# Altium schematic sheet Retroreflective Sensor.SchDoc
size A4; Organization: Altium Limited; Address1: L3, 12a Rodborough Rd; Address2: Frenchs Forest; Address3: NSW; Address4: Australia 2086
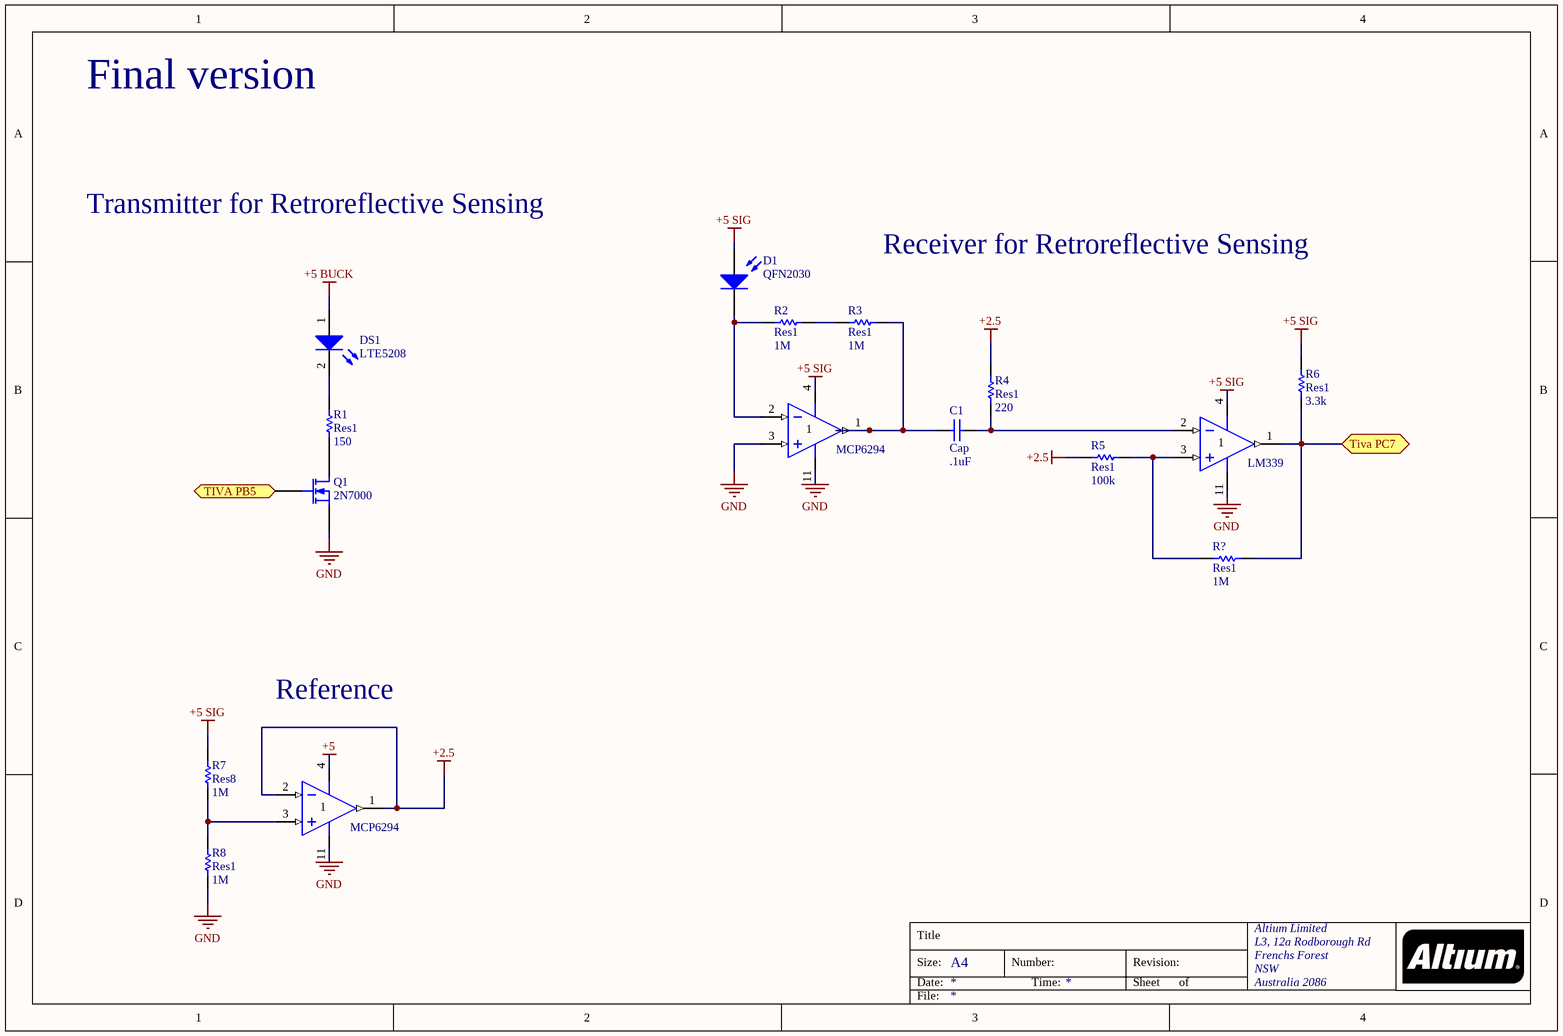
[diagram p0: Retroreflective Sensor.SchDoc]

## Parts
C1  Cap  value .1uF  [RAD-0.3]
D1  QFN2030  [PIN2]
DS1  LTE5208  [LED-0]
Q1  2N7000  [BCY-W3/H.8]
R1  Res1  value 150  [AXIAL-0.3]
R2  Res1  value 1M  [AXIAL-0.3]
R3  Res1  value 1M  [AXIAL-0.3]
R4  Res1  value 220  [AXIAL-0.3]
R5  Res1  value 100k  [AXIAL-0.3]
R6  Res1  value 3.3k  [AXIAL-0.3]
R7  Res8  value 1M  [AXIAL-0.3]
R8  Res1  value 1M  [AXIAL-0.3]
R?  Res1  value 1M  [AXIAL-0.3]
U1  MCP6294  [DIP-14]  (part A of 4)
U2  LM339  [DIP-14]  (part A of 4)
U3  MCP6294  [DIP-14]  (part A of 4)

## Ports
TIVA PB5, Tiva PC7

## Nets
+2.5: R4.2 R5.2 U3.1(OUT) U3.2(IN-)
+5: U3.4(V+)
+5 BUCK: DS1.1(A)
+5 SIG: D1.1(A) R6.1 R7.1 U1.4(V+) U2.4(V+)
GND: Q1.3(S) R8.2 U1.3(IN+) U1.11(GND) U2.11(GND) U3.11(GND)
TIVA PB5: Q1.2(G) ; port TIVA PB5
Tiva PC7: R6.2 R?.1 U2.1(OUT) ; port Tiva PC7
NetC1_1: C1.1 R3.2 U1.1(OUT)
NetC1_2: C1.2 R4.1 U2.2(IN-)
NetD1_2: D1.2(K) R2.1 U1.2(IN-)
NetDS1_2: DS1.2(K) R1.2
NetQ1_1: Q1.1(D) R1.1
NetR2_2: R2.2 R3.1
NetR5_1: R5.1 R?.2 U2.3(IN+)
NetR7_2: R7.2 R8.1 U3.3(IN+)

## Notes on the sheet
- Final version
- Transmitter for Retroreflective Sensing
- Receiver for Retroreflective Sensing
- Reference
- Title
- Size:
- Date:
- A4
- Number:
- Time:
- Revision:
- Sheet
- of
- File:

## Library data of the parts
C1 = Cap: Capacitor; Manufacturer: Generic Components; Class: Passive; Published: 08/06/2000; Publisher: Altium Hobart Technology Centre; SubClass: Capacitor
D1 = Photo Sen: Photosensitive Diode; Manufacturer: Generic Components; Class: Optoelectronic; Published: 1999
DS1 = LED0: Typical INFRARED GaAs LED; Manufacturer: Generic Components; Class: Optoelectronic; Published: 08/06/2000; Publisher: Altium Hobart Technology Centre; SubClass: LED
Q1 = MOSFET-N: N-Channel MOSFET; Manufacturer: Generic Components; Class: Discrete; SubClass: MOSFET - Low Power; Published: 08/06/2000; Publisher: Altium Hobart Technology Centre
R1-R8 R? = Res1: Resistor; Manufacturer: Generic Components; Class: Passive; Published: 08/06/2000; Publisher: Altium Hobart Technology Centre; SubClass: Resistor
U1-U3 = LM324AJ: Low-Power Quad Operational Amplifier; Manufacturer: National Semiconductor; Published: 15/04/2002; Publisher: Altium Hobart Technology Centre; Class: Amplifier; SubClass: Operational Amplifier